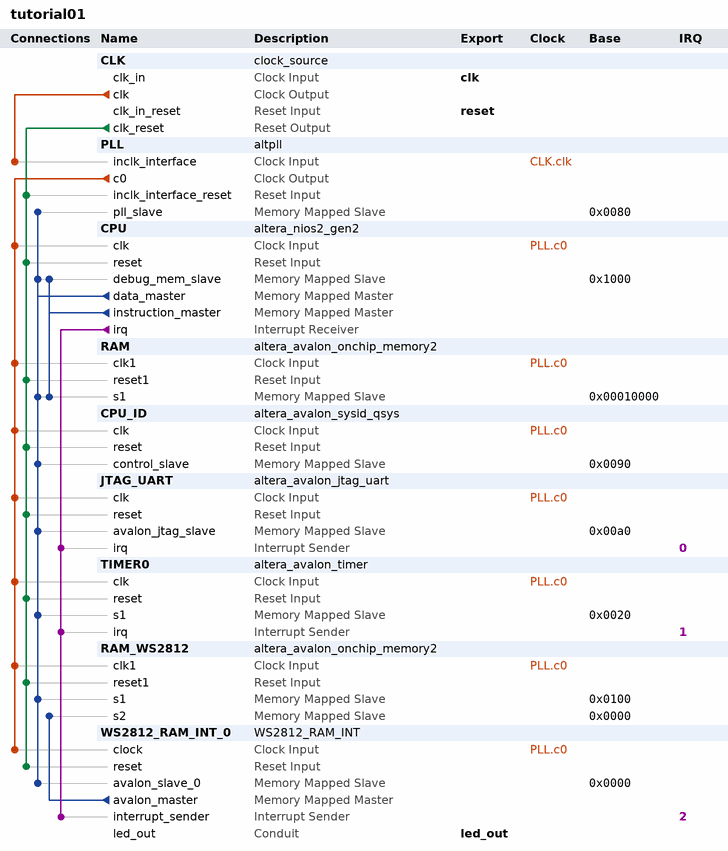
[diagram p0: system contents]
# Platform Designer (Qsys) system tutorial01, MAX 10 10M08DAF256C8G
# Parameters at their usual value, and those the tool derives, are not listed.
package require -exact qsys 18.1
create_system tutorial01
set_project_property DEVICE_FAMILY {MAX 10}
set_project_property DEVICE 10M08DAF256C8G

add_instance CLK clock_source 18.1
set_instance_parameter_value CLK clockFrequency 10000000

add_instance PLL altpll 18.1
set_instance_parameter_value PLL CLK0_DIVIDE_BY 1
set_instance_parameter_value PLL CLK0_MULTIPLY_BY 5
set_instance_parameter_value PLL INCLK0_INPUT_FREQUENCY 100000
set_instance_parameter_value PLL PORT_ARESET PORT_UNUSED
set_instance_parameter_value PLL PORT_LOCKED PORT_UNUSED
set_instance_parameter_value PLL PORT_clk1 PORT_UNUSED
set_instance_parameter_value PLL PORT_clk2 PORT_UNUSED
set_instance_parameter_value PLL PORT_clk3 PORT_UNUSED

add_instance CPU altera_nios2_gen2 18.1
set_instance_parameter_value CPU dcache_size 2048
set_instance_parameter_value CPU exceptionSlave RAM.s1
set_instance_parameter_value CPU icache_size 4096
set_instance_parameter_value CPU impl Tiny
set_instance_parameter_value CPU resetSlave RAM.s1

add_instance RAM altera_avalon_onchip_memory2 18.1
set_instance_parameter_value RAM dataWidth 32
set_instance_parameter_value RAM dualPort false
set_instance_parameter_value RAM initMemContent false
set_instance_parameter_value RAM initializationFileName onchip_mem.hex
set_instance_parameter_value RAM memorySize 32768

add_instance CPU_ID altera_avalon_sysid_qsys 18.1
set_instance_parameter_value CPU_ID id 305419896

add_instance JTAG_UART altera_avalon_jtag_uart 18.1
set_instance_parameter_value JTAG_UART simInteractiveOptions NO_INTERACTIVE_WINDOWS

add_instance TIMER0 altera_avalon_timer 18.1
set_instance_parameter_value TIMER0 period 1
set_instance_parameter_value TIMER0 periodUnits MSEC

add_instance RAM_WS2812 altera_avalon_onchip_memory2 18.1
set_instance_parameter_value RAM_WS2812 dataWidth 32
set_instance_parameter_value RAM_WS2812 dualPort true
set_instance_parameter_value RAM_WS2812 initMemContent false
set_instance_parameter_value RAM_WS2812 initializationFileName onchip_mem.hex
set_instance_parameter_value RAM_WS2812 memorySize 128
set_instance_parameter_value RAM_WS2812 readDuringWriteMode OLD_DATA
set_instance_parameter_value RAM_WS2812 singleClockOperation true

add_instance WS2812_RAM_INT_0 WS2812_RAM_INT 1.0
set_instance_parameter_value WS2812_RAM_INT_0 NUM_DIODES 2

# connections
add_connection CLK.clk PLL.inclk_interface clock
add_connection PLL.c0 CPU.clk clock
add_connection PLL.c0 CPU_ID.clk clock
add_connection PLL.c0 JTAG_UART.clk clock
add_connection PLL.c0 RAM.clk1 clock
add_connection PLL.c0 RAM_WS2812.clk1 clock
add_connection PLL.c0 TIMER0.clk clock
add_connection PLL.c0 WS2812_RAM_INT_0.clock clock
add_connection CLK.clk_reset CPU.reset reset
add_connection CLK.clk_reset CPU_ID.reset reset
add_connection CLK.clk_reset JTAG_UART.reset reset
add_connection CLK.clk_reset PLL.inclk_interface_reset reset
add_connection CLK.clk_reset RAM.reset1 reset
add_connection CLK.clk_reset RAM_WS2812.reset1 reset
add_connection CLK.clk_reset TIMER0.reset reset
add_connection CLK.clk_reset WS2812_RAM_INT_0.reset reset
add_connection CPU.data_master CPU.debug_mem_slave avalon
set_connection_parameter_value CPU.data_master/CPU.debug_mem_slave baseAddress 0x1000
add_connection CPU.data_master CPU_ID.control_slave avalon
set_connection_parameter_value CPU.data_master/CPU_ID.control_slave baseAddress 0x0090
add_connection CPU.data_master JTAG_UART.avalon_jtag_slave avalon
set_connection_parameter_value CPU.data_master/JTAG_UART.avalon_jtag_slave baseAddress 0x00a0
add_connection CPU.data_master PLL.pll_slave avalon
set_connection_parameter_value CPU.data_master/PLL.pll_slave baseAddress 0x0080
add_connection CPU.data_master RAM.s1 avalon
set_connection_parameter_value CPU.data_master/RAM.s1 baseAddress 0x00010000
add_connection CPU.data_master RAM_WS2812.s1 avalon
set_connection_parameter_value CPU.data_master/RAM_WS2812.s1 baseAddress 0x0100
add_connection CPU.data_master TIMER0.s1 avalon
set_connection_parameter_value CPU.data_master/TIMER0.s1 baseAddress 0x0020
add_connection CPU.data_master WS2812_RAM_INT_0.avalon_slave_0 avalon
set_connection_parameter_value CPU.data_master/WS2812_RAM_INT_0.avalon_slave_0 baseAddress 0x0000
add_connection CPU.instruction_master CPU.debug_mem_slave avalon
set_connection_parameter_value CPU.instruction_master/CPU.debug_mem_slave baseAddress 0x1000
add_connection CPU.instruction_master RAM.s1 avalon
set_connection_parameter_value CPU.instruction_master/RAM.s1 baseAddress 0x00010000
add_connection WS2812_RAM_INT_0.avalon_master RAM_WS2812.s2 avalon
set_connection_parameter_value WS2812_RAM_INT_0.avalon_master/RAM_WS2812.s2 baseAddress 0x0000
add_connection CPU.irq JTAG_UART.irq interrupt
set_connection_parameter_value CPU.irq/JTAG_UART.irq irqNumber 0
add_connection CPU.irq TIMER0.irq interrupt
set_connection_parameter_value CPU.irq/TIMER0.irq irqNumber 1
add_connection CPU.irq WS2812_RAM_INT_0.interrupt_sender interrupt
set_connection_parameter_value CPU.irq/WS2812_RAM_INT_0.interrupt_sender irqNumber 2

# exported interfaces
add_interface clk clock sink
set_interface_property clk EXPORT_OF CLK.clk_in
add_interface led_out conduit end
set_interface_property led_out EXPORT_OF WS2812_RAM_INT_0.led_out
add_interface reset reset sink
set_interface_property reset EXPORT_OF CLK.clk_in_reset

set_interconnect_requirement {$system} qsys_mm.clockCrossingAdapter HANDSHAKE
set_interconnect_requirement {$system} qsys_mm.enableEccProtection FALSE
set_interconnect_requirement {$system} qsys_mm.insertDefaultSlave FALSE
set_interconnect_requirement {$system} qsys_mm.maxAdditionalLatency 1

save_system tutorial01.qsys
